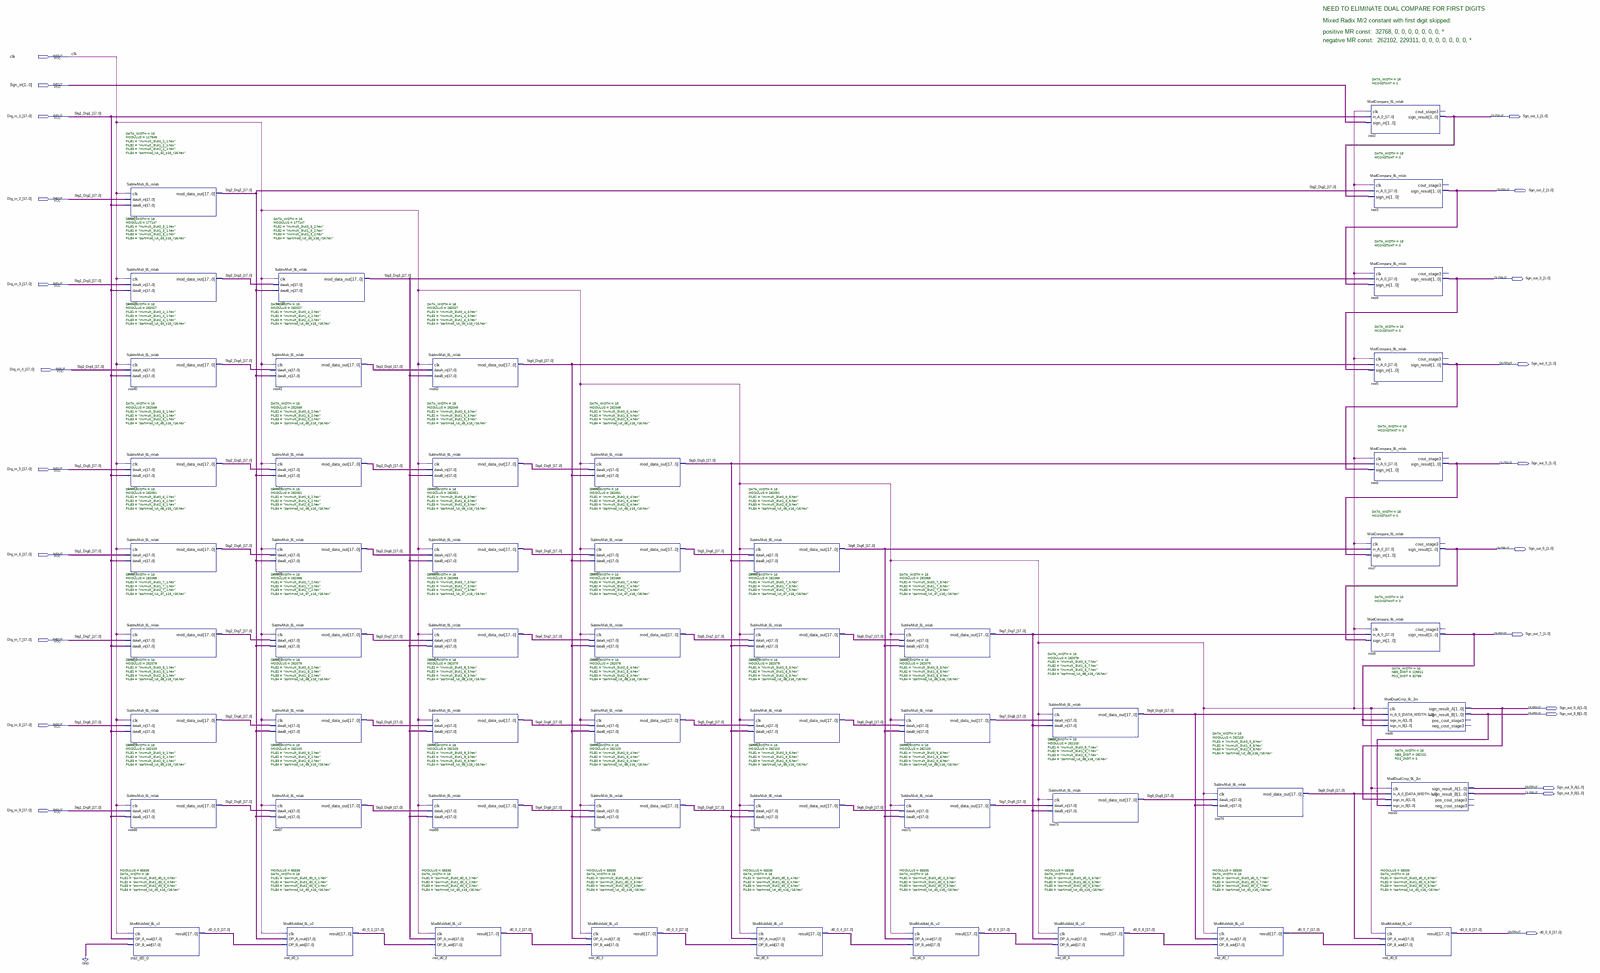
[diagram p0: schematic sheet, whole]
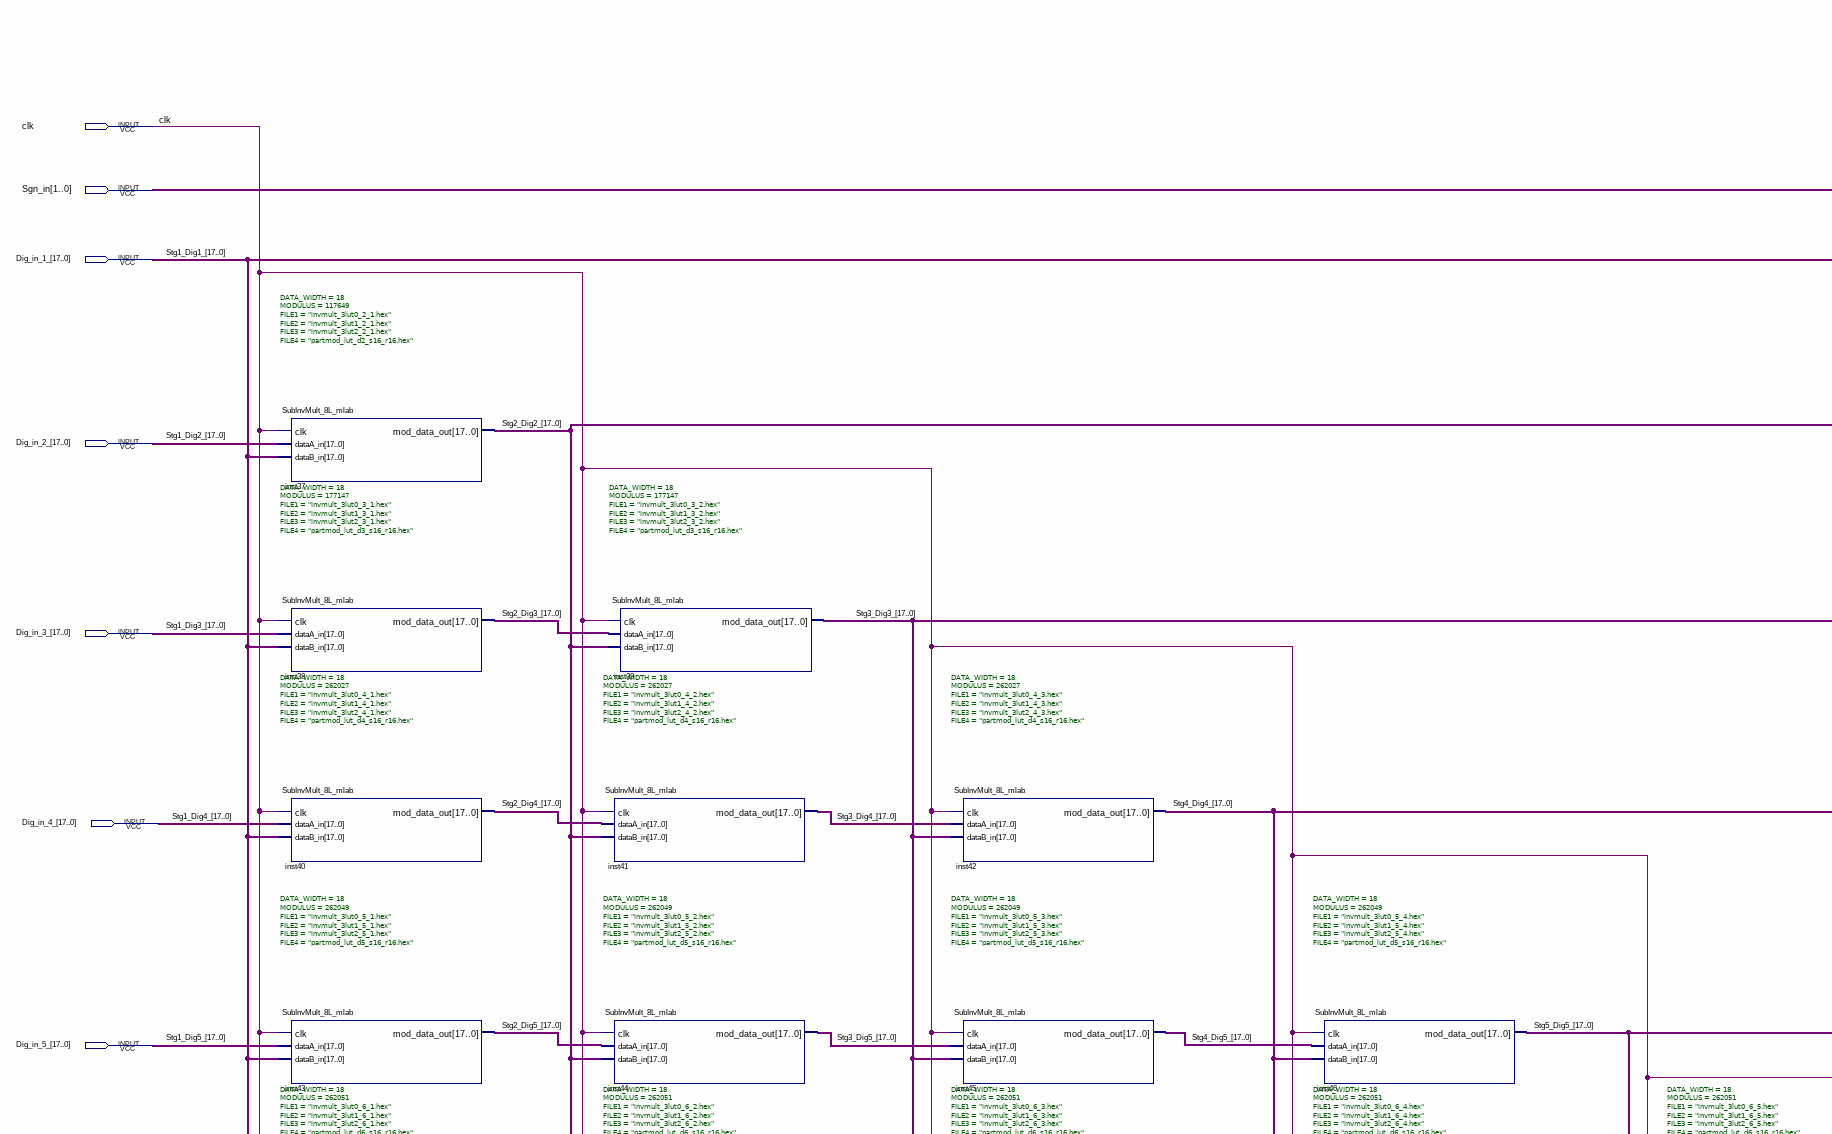
[diagram p1: schematic sheet, upper left part]
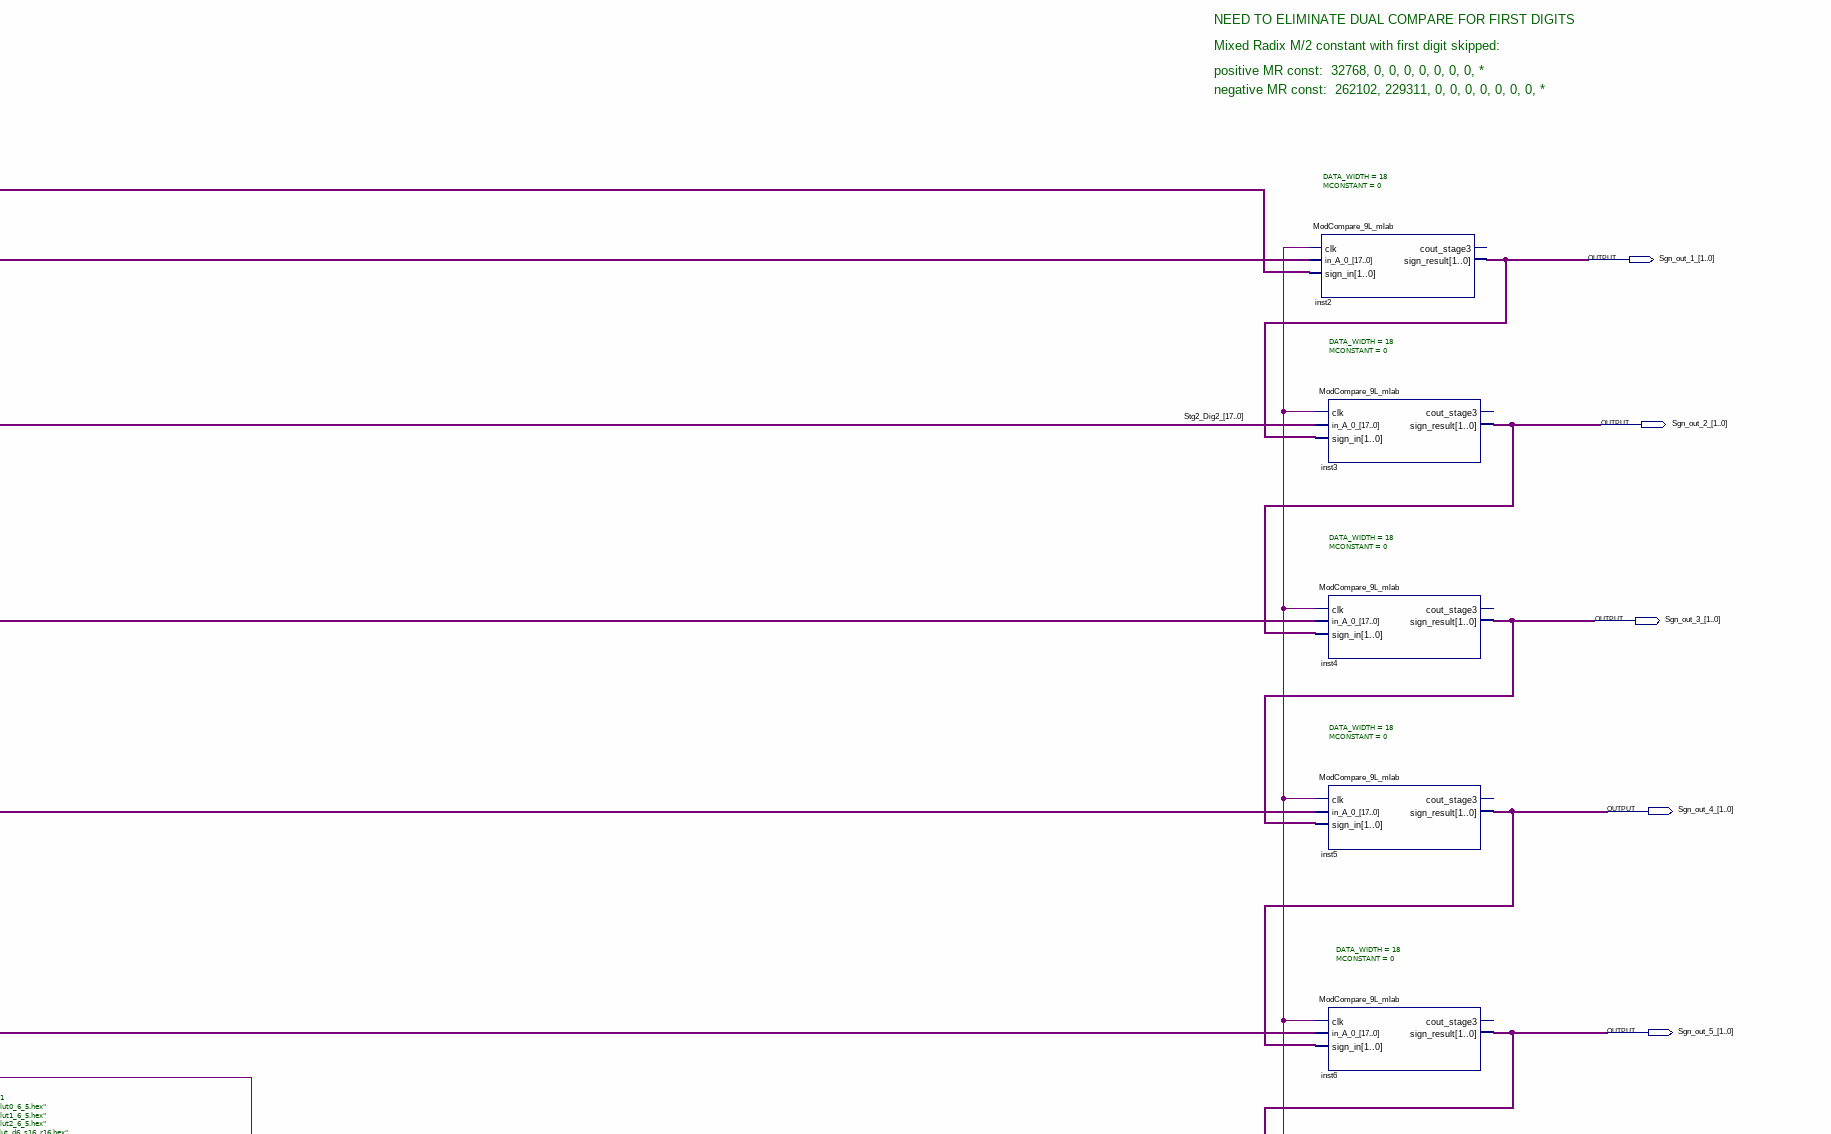
[diagram p2: schematic sheet, upper right part]
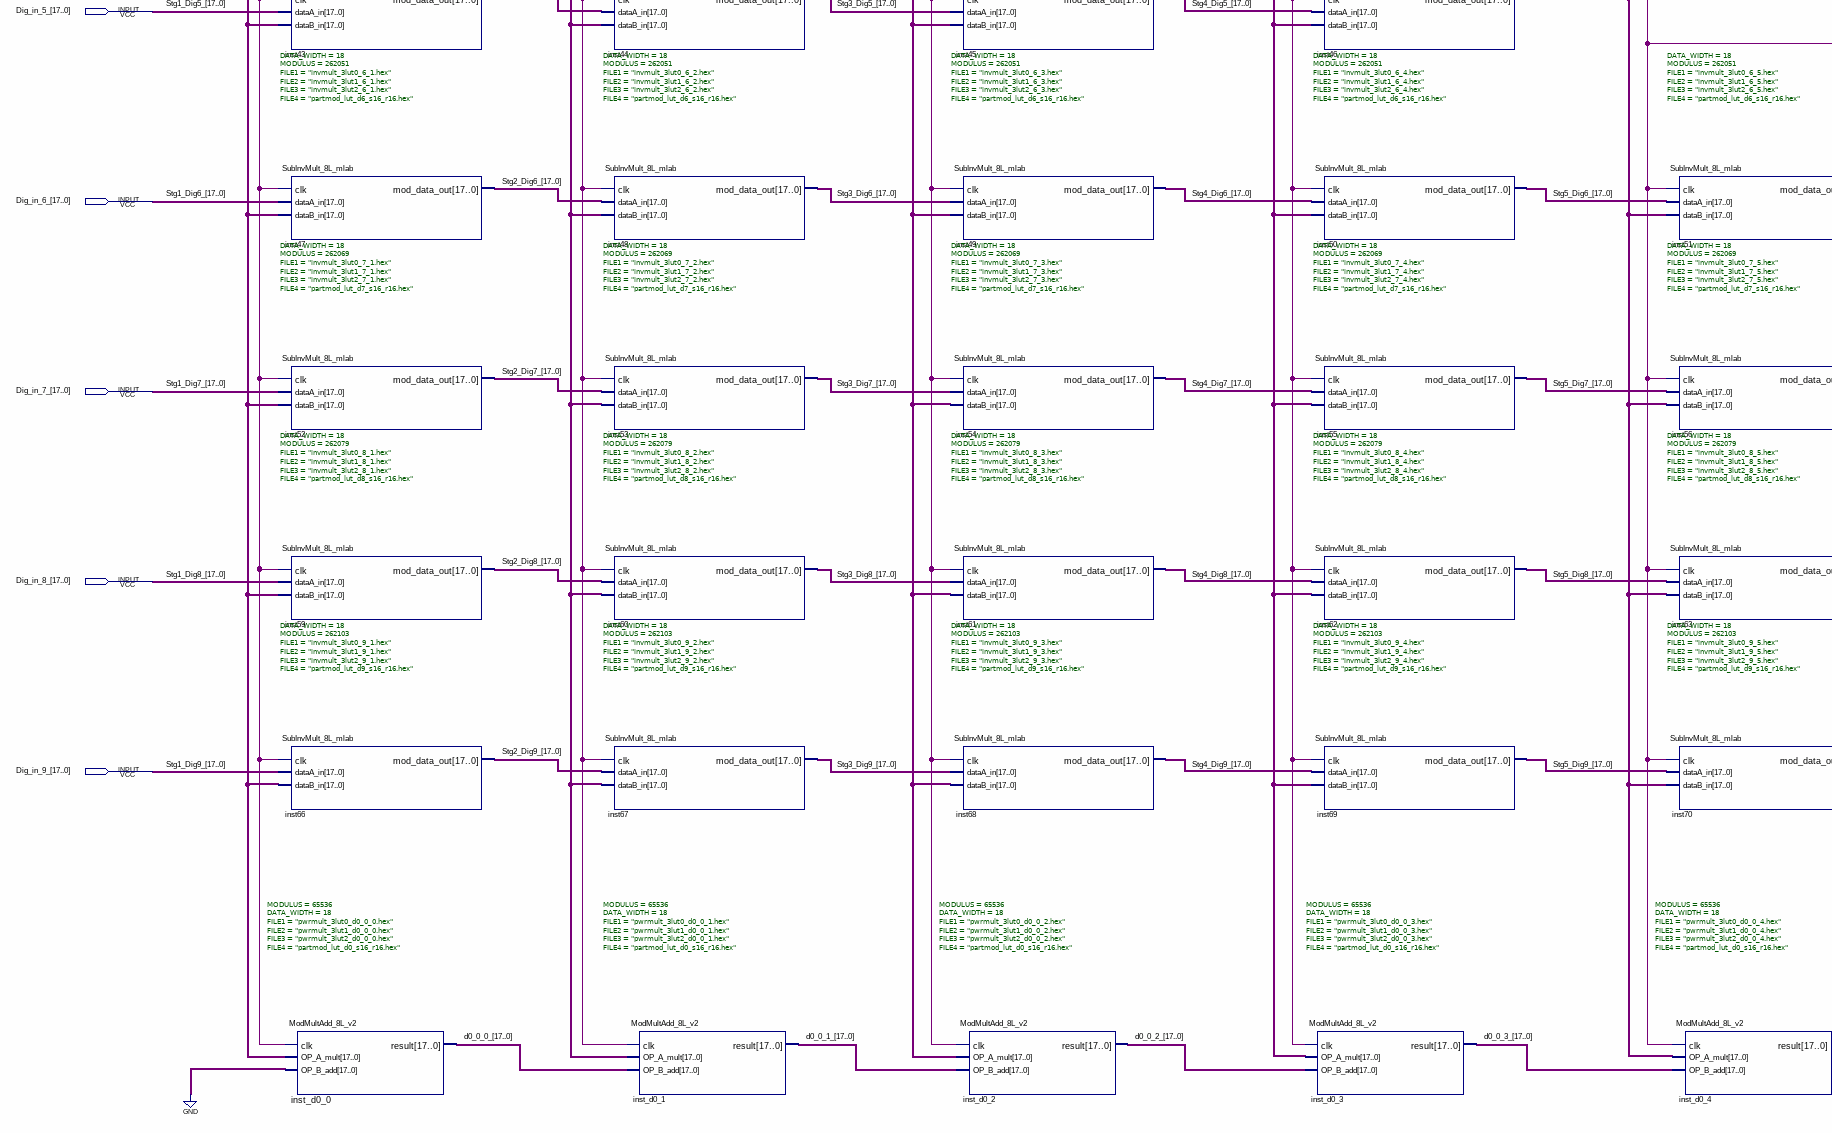
[diagram p3: schematic sheet, lower left part]
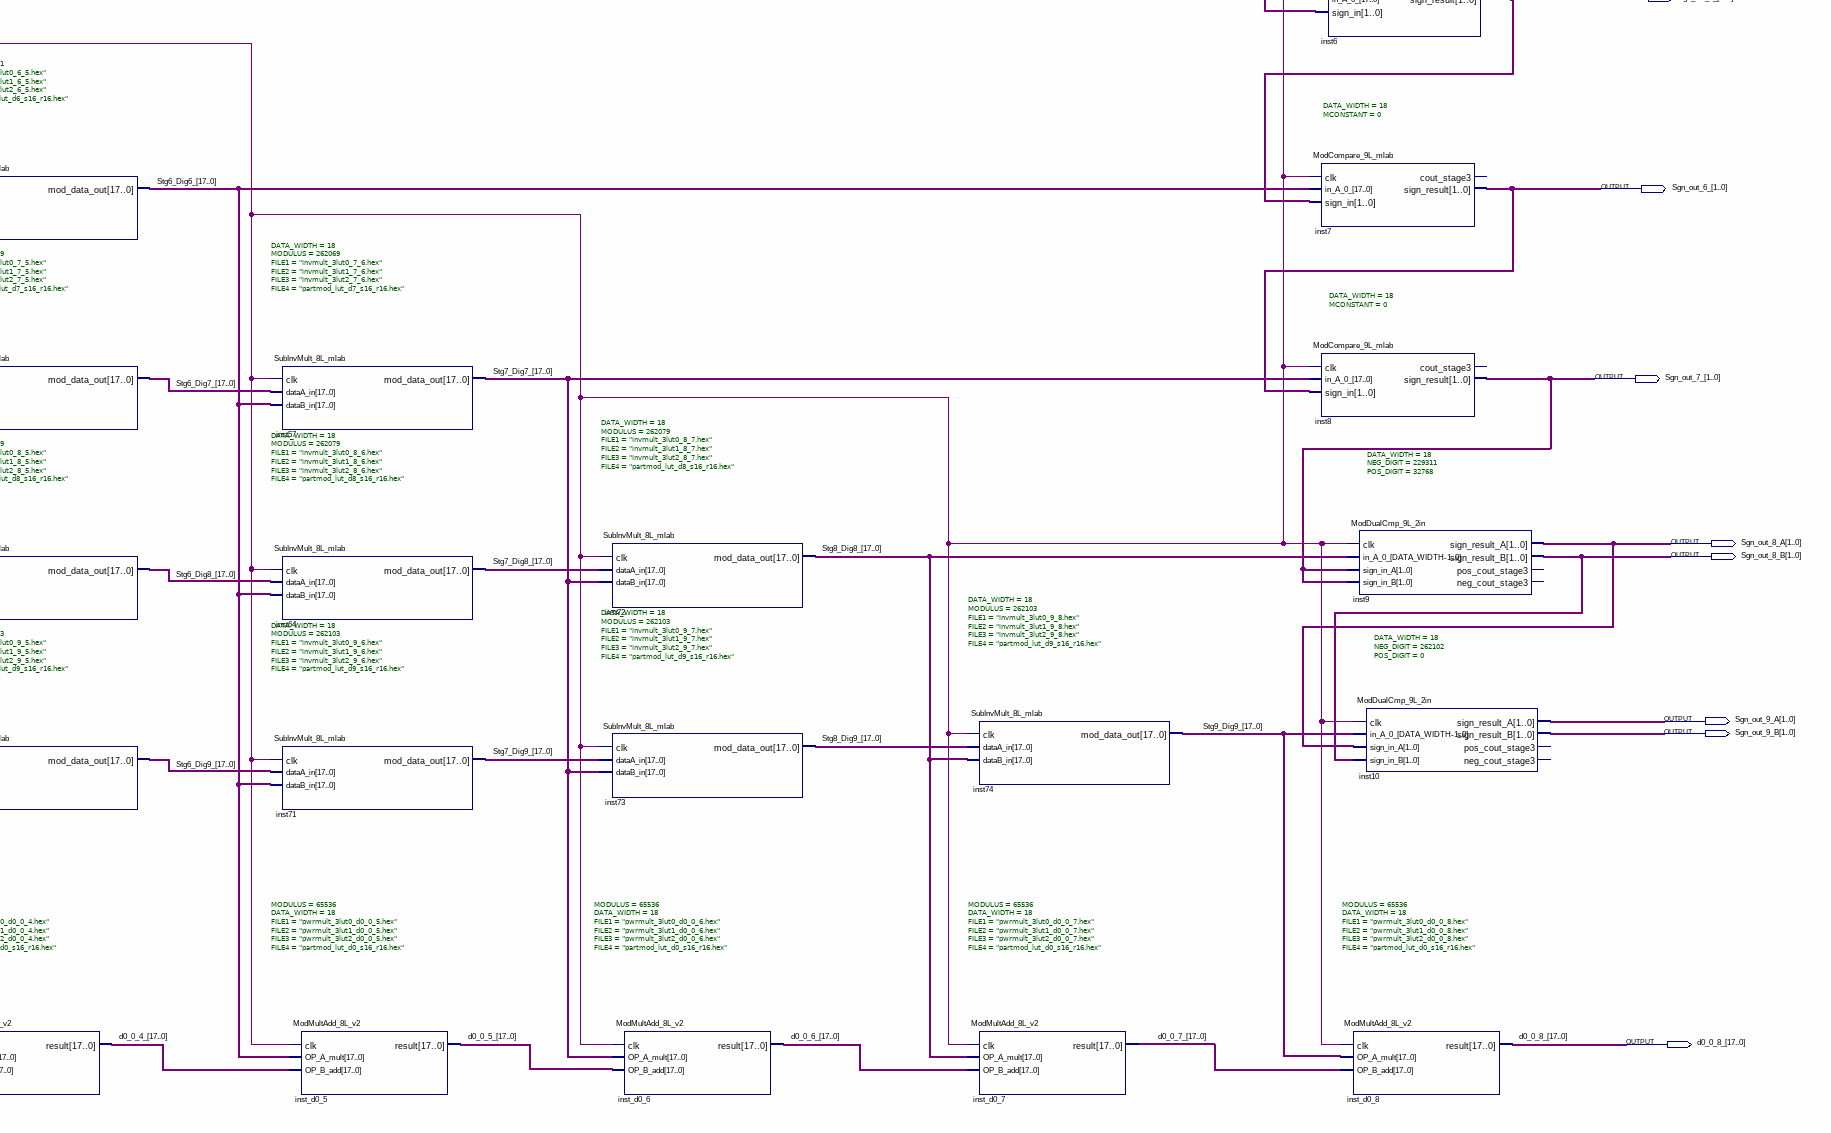
[diagram p4: schematic sheet, lower right part]
// Quartus schematic MRC_pipe_mlab_ec_skp0.bdf as structural Verilog: 54 symbols, 23 pins
module MRC_pipe_mlab_ec_skp0 (
  input  clk,
  input  [1:0] Sgn_in,
  input  [17:0] Dig_in_1_,
  input  [17:0] Dig_in_2_,
  input  [17:0] Dig_in_3_,
  input  [17:0] Dig_in_4_,
  input  [17:0] Dig_in_5_,
  input  [17:0] Dig_in_6_,
  input  [17:0] Dig_in_7_,
  input  [17:0] Dig_in_8_,
  input  [17:0] Dig_in_9_,
  output [1:0] Sgn_out_1_,
  output [1:0] Sgn_out_2_,
  output [1:0] Sgn_out_3_,
  output [1:0] Sgn_out_4_,
  output [1:0] Sgn_out_5_,
  output [1:0] Sgn_out_6_,
  output [1:0] Sgn_out_7_,
  output [1:0] Sgn_out_8_A,
  output [1:0] Sgn_out_8_B,
  output [1:0] Sgn_out_9_A,
  output [1:0] Sgn_out_9_B,
  output [17:0] d0_0_8_
);

  wire [17:0] d0_0_0_, d0_0_1_, d0_0_2_, d0_0_3_, d0_0_4_, d0_0_5_, d0_0_6_, d0_0_7_, Stg2_Dig2_, Stg2_Dig3_,
       Stg2_Dig4_, Stg2_Dig5_, Stg2_Dig6_, Stg2_Dig7_, Stg2_Dig8_, Stg2_Dig9_, Stg3_Dig3_, Stg3_Dig4_,
       Stg3_Dig5_, Stg3_Dig6_, Stg3_Dig7_, Stg3_Dig8_, Stg3_Dig9_, Stg4_Dig4_, Stg4_Dig5_, Stg4_Dig6_,
       Stg4_Dig7_, Stg4_Dig8_, Stg4_Dig9_, Stg5_Dig5_, Stg5_Dig6_, Stg5_Dig7_, Stg5_Dig8_, Stg5_Dig9_,
       Stg6_Dig6_, Stg6_Dig7_, Stg6_Dig8_, Stg6_Dig9_, Stg7_Dig7_, Stg7_Dig8_, Stg7_Dig9_, Stg8_Dig8_,
       Stg8_Dig9_, Stg9_Dig9_;

  SubInvMult_8L_mlab #(.DATA_WIDTH(18), .MODULUS(117649), .FILE1("invmult_3lut0_2_1.hex"), .FILE2("invmult_3lut1_2_1.hex"), .FILE3("invmult_3lut2_2_1.hex"), .FILE4("partmod_lut_d2_s16_r16.hex")) inst37 (
    .clk(clk), .dataA_in(Dig_in_2_), .dataB_in(Dig_in_1_), .mod_data_out(Stg2_Dig2_));
  SubInvMult_8L_mlab #(.DATA_WIDTH(18), .MODULUS(177147), .FILE1("invmult_3lut0_3_1.hex"), .FILE2("invmult_3lut1_3_1.hex"), .FILE3("invmult_3lut2_3_1.hex"), .FILE4("partmod_lut_d3_s16_r16.hex")) inst38 (
    .clk(clk), .dataA_in(Dig_in_3_), .dataB_in(Dig_in_1_), .mod_data_out(Stg2_Dig3_));
  SubInvMult_8L_mlab #(.DATA_WIDTH(18), .MODULUS(262027), .FILE1("invmult_3lut0_4_1.hex"), .FILE2("invmult_3lut1_4_1.hex"), .FILE3("invmult_3lut2_4_1.hex"), .FILE4("partmod_lut_d4_s16_r16.hex")) inst40 (
    .clk(clk), .dataA_in(Dig_in_4_), .dataB_in(Dig_in_1_), .mod_data_out(Stg2_Dig4_));
  SubInvMult_8L_mlab #(.DATA_WIDTH(18), .MODULUS(262049), .FILE1("invmult_3lut0_5_1.hex"), .FILE2("invmult_3lut1_5_1.hex"), .FILE3("invmult_3lut2_5_1.hex"), .FILE4("partmod_lut_d5_s16_r16.hex")) inst43 (
    .clk(clk), .dataA_in(Dig_in_5_), .dataB_in(Dig_in_1_), .mod_data_out(Stg2_Dig5_));
  SubInvMult_8L_mlab #(.DATA_WIDTH(18), .MODULUS(262051), .FILE1("invmult_3lut0_6_1.hex"), .FILE2("invmult_3lut1_6_1.hex"), .FILE3("invmult_3lut2_6_1.hex"), .FILE4("partmod_lut_d6_s16_r16.hex")) inst47 (
    .clk(clk), .dataA_in(Dig_in_6_), .dataB_in(Dig_in_1_), .mod_data_out(Stg2_Dig6_));
  SubInvMult_8L_mlab #(.DATA_WIDTH(18), .MODULUS(262069), .FILE1("invmult_3lut0_7_1.hex"), .FILE2("invmult_3lut1_7_1.hex"), .FILE3("invmult_3lut2_7_1.hex"), .FILE4("partmod_lut_d7_s16_r16.hex")) inst52 (
    .clk(clk), .dataA_in(Dig_in_7_), .dataB_in(Dig_in_1_), .mod_data_out(Stg2_Dig7_));
  SubInvMult_8L_mlab #(.DATA_WIDTH(18), .MODULUS(262079), .FILE1("invmult_3lut0_8_1.hex"), .FILE2("invmult_3lut1_8_1.hex"), .FILE3("invmult_3lut2_8_1.hex"), .FILE4("partmod_lut_d8_s16_r16.hex")) inst59 (
    .clk(clk), .dataA_in(Dig_in_8_), .dataB_in(Dig_in_1_), .mod_data_out(Stg2_Dig8_));
  SubInvMult_8L_mlab #(.DATA_WIDTH(18), .MODULUS(262103), .FILE1("invmult_3lut0_9_1.hex"), .FILE2("invmult_3lut1_9_1.hex"), .FILE3("invmult_3lut2_9_1.hex"), .FILE4("partmod_lut_d9_s16_r16.hex")) inst66 (
    .clk(clk), .dataA_in(Dig_in_9_), .dataB_in(Dig_in_1_), .mod_data_out(Stg2_Dig9_));
  ModMultAdd_8L_v2 #(.MODULUS(65536), .DATA_WIDTH(18), .FILE1("pwrmult_3lut0_d0_0_0.hex"), .FILE2("pwrmult_3lut1_d0_0_0.hex"), .FILE3("pwrmult_3lut2_d0_0_0.hex"), .FILE4("partmod_lut_d0_s16_r16.hex")) inst_d0_0 (
    .clk(clk), .OP_A_mult(Dig_in_1_), .OP_B_add({18{1'b0}}), .result(d0_0_0_));
  SubInvMult_8L_mlab #(.DATA_WIDTH(18), .MODULUS(177147), .FILE1("invmult_3lut0_3_2.hex"), .FILE2("invmult_3lut1_3_2.hex"), .FILE3("invmult_3lut2_3_2.hex"), .FILE4("partmod_lut_d3_s16_r16.hex")) inst39 (
    .clk(clk), .dataA_in(Stg2_Dig3_), .dataB_in(Stg2_Dig2_), .mod_data_out(Stg3_Dig3_));
  SubInvMult_8L_mlab #(.DATA_WIDTH(18), .MODULUS(262027), .FILE1("invmult_3lut0_4_2.hex"), .FILE2("invmult_3lut1_4_2.hex"), .FILE3("invmult_3lut2_4_2.hex"), .FILE4("partmod_lut_d4_s16_r16.hex")) inst41 (
    .clk(clk), .dataA_in(Stg2_Dig4_), .dataB_in(Stg2_Dig2_), .mod_data_out(Stg3_Dig4_));
  SubInvMult_8L_mlab #(.DATA_WIDTH(18), .MODULUS(262049), .FILE1("invmult_3lut0_5_2.hex"), .FILE2("invmult_3lut1_5_2.hex"), .FILE3("invmult_3lut2_5_2.hex"), .FILE4("partmod_lut_d5_s16_r16.hex")) inst44 (
    .clk(clk), .dataA_in(Stg2_Dig5_), .dataB_in(Stg2_Dig2_), .mod_data_out(Stg3_Dig5_));
  SubInvMult_8L_mlab #(.DATA_WIDTH(18), .MODULUS(262051), .FILE1("invmult_3lut0_6_2.hex"), .FILE2("invmult_3lut1_6_2.hex"), .FILE3("invmult_3lut2_6_2.hex"), .FILE4("partmod_lut_d6_s16_r16.hex")) inst48 (
    .clk(clk), .dataA_in(Stg2_Dig6_), .dataB_in(Stg2_Dig2_), .mod_data_out(Stg3_Dig6_));
  SubInvMult_8L_mlab #(.DATA_WIDTH(18), .MODULUS(262069), .FILE1("invmult_3lut0_7_2.hex"), .FILE2("invmult_3lut1_7_2.hex"), .FILE3("invmult_3lut2_7_2.hex"), .FILE4("partmod_lut_d7_s16_r16.hex")) inst53 (
    .clk(clk), .dataA_in(Stg2_Dig7_), .dataB_in(Stg2_Dig2_), .mod_data_out(Stg3_Dig7_));
  SubInvMult_8L_mlab #(.DATA_WIDTH(18), .MODULUS(262079), .FILE1("invmult_3lut0_8_2.hex"), .FILE2("invmult_3lut1_8_2.hex"), .FILE3("invmult_3lut2_8_2.hex"), .FILE4("partmod_lut_d8_s16_r16.hex")) inst60 (
    .clk(clk), .dataA_in(Stg2_Dig8_), .dataB_in(Stg2_Dig2_), .mod_data_out(Stg3_Dig8_));
  SubInvMult_8L_mlab #(.DATA_WIDTH(18), .MODULUS(262103), .FILE1("invmult_3lut0_9_2.hex"), .FILE2("invmult_3lut1_9_2.hex"), .FILE3("invmult_3lut2_9_2.hex"), .FILE4("partmod_lut_d9_s16_r16.hex")) inst67 (
    .clk(clk), .dataA_in(Stg2_Dig9_), .dataB_in(Stg2_Dig2_), .mod_data_out(Stg3_Dig9_));
  ModMultAdd_8L_v2 #(.MODULUS(65536), .DATA_WIDTH(18), .FILE1("pwrmult_3lut0_d0_0_1.hex"), .FILE2("pwrmult_3lut1_d0_0_1.hex"), .FILE3("pwrmult_3lut2_d0_0_1.hex"), .FILE4("partmod_lut_d0_s16_r16.hex")) inst_d0_1 (
    .clk(clk), .OP_A_mult(Stg2_Dig2_), .OP_B_add(d0_0_0_), .result(d0_0_1_));
  SubInvMult_8L_mlab #(.DATA_WIDTH(18), .MODULUS(262027), .FILE1("invmult_3lut0_4_3.hex"), .FILE2("invmult_3lut1_4_3.hex"), .FILE3("invmult_3lut2_4_3.hex"), .FILE4("partmod_lut_d4_s16_r16.hex")) inst42 (
    .clk(clk), .dataA_in(Stg3_Dig4_), .dataB_in(Stg3_Dig3_), .mod_data_out(Stg4_Dig4_));
  SubInvMult_8L_mlab #(.DATA_WIDTH(18), .MODULUS(262049), .FILE1("invmult_3lut0_5_3.hex"), .FILE2("invmult_3lut1_5_3.hex"), .FILE3("invmult_3lut2_5_3.hex"), .FILE4("partmod_lut_d5_s16_r16.hex")) inst45 (
    .clk(clk), .dataA_in(Stg3_Dig5_), .dataB_in(Stg3_Dig3_), .mod_data_out(Stg4_Dig5_));
  SubInvMult_8L_mlab #(.DATA_WIDTH(18), .MODULUS(262051), .FILE1("invmult_3lut0_6_3.hex"), .FILE2("invmult_3lut1_6_3.hex"), .FILE3("invmult_3lut2_6_3.hex"), .FILE4("partmod_lut_d6_s16_r16.hex")) inst49 (
    .clk(clk), .dataA_in(Stg3_Dig6_), .dataB_in(Stg3_Dig3_), .mod_data_out(Stg4_Dig6_));
  SubInvMult_8L_mlab #(.DATA_WIDTH(18), .MODULUS(262069), .FILE1("invmult_3lut0_7_3.hex"), .FILE2("invmult_3lut1_7_3.hex"), .FILE3("invmult_3lut2_7_3.hex"), .FILE4("partmod_lut_d7_s16_r16.hex")) inst54 (
    .clk(clk), .dataA_in(Stg3_Dig7_), .dataB_in(Stg3_Dig3_), .mod_data_out(Stg4_Dig7_));
  SubInvMult_8L_mlab #(.DATA_WIDTH(18), .MODULUS(262079), .FILE1("invmult_3lut0_8_3.hex"), .FILE2("invmult_3lut1_8_3.hex"), .FILE3("invmult_3lut2_8_3.hex"), .FILE4("partmod_lut_d8_s16_r16.hex")) inst61 (
    .clk(clk), .dataA_in(Stg3_Dig8_), .dataB_in(Stg3_Dig3_), .mod_data_out(Stg4_Dig8_));
  SubInvMult_8L_mlab #(.DATA_WIDTH(18), .MODULUS(262103), .FILE1("invmult_3lut0_9_3.hex"), .FILE2("invmult_3lut1_9_3.hex"), .FILE3("invmult_3lut2_9_3.hex"), .FILE4("partmod_lut_d9_s16_r16.hex")) inst68 (
    .clk(clk), .dataA_in(Stg3_Dig9_), .dataB_in(Stg3_Dig3_), .mod_data_out(Stg4_Dig9_));
  ModMultAdd_8L_v2 #(.MODULUS(65536), .DATA_WIDTH(18), .FILE1("pwrmult_3lut0_d0_0_2.hex"), .FILE2("pwrmult_3lut1_d0_0_2.hex"), .FILE3("pwrmult_3lut2_d0_0_2.hex"), .FILE4("partmod_lut_d0_s16_r16.hex")) inst_d0_2 (
    .clk(clk), .OP_A_mult(Stg3_Dig3_), .OP_B_add(d0_0_1_), .result(d0_0_2_));
  ModMultAdd_8L_v2 #(.MODULUS(65536), .DATA_WIDTH(18), .FILE1("pwrmult_3lut0_d0_0_3.hex"), .FILE2("pwrmult_3lut1_d0_0_3.hex"), .FILE3("pwrmult_3lut2_d0_0_3.hex"), .FILE4("partmod_lut_d0_s16_r16.hex")) inst_d0_3 (
    .clk(clk), .OP_A_mult(Stg4_Dig4_), .OP_B_add(d0_0_2_), .result(d0_0_3_));
  SubInvMult_8L_mlab #(.DATA_WIDTH(18), .MODULUS(262049), .FILE1("invmult_3lut0_5_4.hex"), .FILE2("invmult_3lut1_5_4.hex"), .FILE3("invmult_3lut2_5_4.hex"), .FILE4("partmod_lut_d5_s16_r16.hex")) inst46 (
    .clk(clk), .dataA_in(Stg4_Dig5_), .dataB_in(Stg4_Dig4_), .mod_data_out(Stg5_Dig5_));
  SubInvMult_8L_mlab #(.DATA_WIDTH(18), .MODULUS(262051), .FILE1("invmult_3lut0_6_4.hex"), .FILE2("invmult_3lut1_6_4.hex"), .FILE3("invmult_3lut2_6_4.hex"), .FILE4("partmod_lut_d6_s16_r16.hex")) inst50 (
    .clk(clk), .dataA_in(Stg4_Dig6_), .dataB_in(Stg4_Dig4_), .mod_data_out(Stg5_Dig6_));
  SubInvMult_8L_mlab #(.DATA_WIDTH(18), .MODULUS(262069), .FILE1("invmult_3lut0_7_4.hex"), .FILE2("invmult_3lut1_7_4.hex"), .FILE3("invmult_3lut2_7_4.hex"), .FILE4("partmod_lut_d7_s16_r16.hex")) inst55 (
    .clk(clk), .dataA_in(Stg4_Dig7_), .dataB_in(Stg4_Dig4_), .mod_data_out(Stg5_Dig7_));
  SubInvMult_8L_mlab #(.DATA_WIDTH(18), .MODULUS(262079), .FILE1("invmult_3lut0_8_4.hex"), .FILE2("invmult_3lut1_8_4.hex"), .FILE3("invmult_3lut2_8_4.hex"), .FILE4("partmod_lut_d8_s16_r16.hex")) inst62 (
    .clk(clk), .dataA_in(Stg4_Dig8_), .dataB_in(Stg4_Dig4_), .mod_data_out(Stg5_Dig8_));
  SubInvMult_8L_mlab #(.DATA_WIDTH(18), .MODULUS(262103), .FILE1("invmult_3lut0_9_4.hex"), .FILE2("invmult_3lut1_9_4.hex"), .FILE3("invmult_3lut2_9_4.hex"), .FILE4("partmod_lut_d9_s16_r16.hex")) inst69 (
    .clk(clk), .dataA_in(Stg4_Dig9_), .dataB_in(Stg4_Dig4_), .mod_data_out(Stg5_Dig9_));
  SubInvMult_8L_mlab #(.DATA_WIDTH(18), .MODULUS(262051), .FILE1("invmult_3lut0_6_5.hex"), .FILE2("invmult_3lut1_6_5.hex"), .FILE3("invmult_3lut2_6_5.hex"), .FILE4("partmod_lut_d6_s16_r16.hex")) inst51 (
    .clk(clk), .dataA_in(Stg5_Dig6_), .dataB_in(Stg5_Dig5_), .mod_data_out(Stg6_Dig6_));
  SubInvMult_8L_mlab #(.DATA_WIDTH(18), .MODULUS(262069), .FILE1("invmult_3lut0_7_5.hex"), .FILE2("invmult_3lut1_7_5.hex"), .FILE3("invmult_3lut2_7_5.hex"), .FILE4("partmod_lut_d7_s16_r16.hex")) inst56 (
    .clk(clk), .dataA_in(Stg5_Dig7_), .dataB_in(Stg5_Dig5_), .mod_data_out(Stg6_Dig7_));
  SubInvMult_8L_mlab #(.DATA_WIDTH(18), .MODULUS(262079), .FILE1("invmult_3lut0_8_5.hex"), .FILE2("invmult_3lut1_8_5.hex"), .FILE3("invmult_3lut2_8_5.hex"), .FILE4("partmod_lut_d8_s16_r16.hex")) inst63 (
    .clk(clk), .dataA_in(Stg5_Dig8_), .dataB_in(Stg5_Dig5_), .mod_data_out(Stg6_Dig8_));
  SubInvMult_8L_mlab #(.DATA_WIDTH(18), .MODULUS(262103), .FILE1("invmult_3lut0_9_5.hex"), .FILE2("invmult_3lut1_9_5.hex"), .FILE3("invmult_3lut2_9_5.hex"), .FILE4("partmod_lut_d9_s16_r16.hex")) inst70 (
    .clk(clk), .dataA_in(Stg5_Dig9_), .dataB_in(Stg5_Dig5_), .mod_data_out(Stg6_Dig9_));
  ModMultAdd_8L_v2 #(.MODULUS(65536), .DATA_WIDTH(18), .FILE1("pwrmult_3lut0_d0_0_4.hex"), .FILE2("pwrmult_3lut1_d0_0_4.hex"), .FILE3("pwrmult_3lut2_d0_0_4.hex"), .FILE4("partmod_lut_d0_s16_r16.hex")) inst_d0_4 (
    .clk(clk), .OP_A_mult(Stg5_Dig5_), .OP_B_add(d0_0_3_), .result(d0_0_4_));
  SubInvMult_8L_mlab #(.DATA_WIDTH(18), .MODULUS(262069), .FILE1("invmult_3lut0_7_6.hex"), .FILE2("invmult_3lut1_7_6.hex"), .FILE3("invmult_3lut2_7_6.hex"), .FILE4("partmod_lut_d7_s16_r16.hex")) inst57 (
    .clk(clk), .dataA_in(Stg6_Dig7_), .dataB_in(Stg6_Dig6_), .mod_data_out(Stg7_Dig7_));
  SubInvMult_8L_mlab #(.DATA_WIDTH(18), .MODULUS(262079), .FILE1("invmult_3lut0_8_6.hex"), .FILE2("invmult_3lut1_8_6.hex"), .FILE3("invmult_3lut2_8_6.hex"), .FILE4("partmod_lut_d8_s16_r16.hex")) inst64 (
    .clk(clk), .dataA_in(Stg6_Dig8_), .dataB_in(Stg6_Dig6_), .mod_data_out(Stg7_Dig8_));
  SubInvMult_8L_mlab #(.DATA_WIDTH(18), .MODULUS(262103), .FILE1("invmult_3lut0_9_6.hex"), .FILE2("invmult_3lut1_9_6.hex"), .FILE3("invmult_3lut2_9_6.hex"), .FILE4("partmod_lut_d9_s16_r16.hex")) inst71 (
    .clk(clk), .dataA_in(Stg6_Dig9_), .dataB_in(Stg6_Dig6_), .mod_data_out(Stg7_Dig9_));
  ModMultAdd_8L_v2 #(.MODULUS(65536), .DATA_WIDTH(18), .FILE1("pwrmult_3lut0_d0_0_5.hex"), .FILE2("pwrmult_3lut1_d0_0_5.hex"), .FILE3("pwrmult_3lut2_d0_0_5.hex"), .FILE4("partmod_lut_d0_s16_r16.hex")) inst_d0_5 (
    .clk(clk), .OP_A_mult(Stg6_Dig6_), .OP_B_add(d0_0_4_), .result(d0_0_5_));
  SubInvMult_8L_mlab #(.DATA_WIDTH(18), .MODULUS(262079), .FILE1("invmult_3lut0_8_7.hex"), .FILE2("invmult_3lut1_8_7.hex"), .FILE3("invmult_3lut2_8_7.hex"), .FILE4("partmod_lut_d8_s16_r16.hex")) inst72 (
    .clk(clk), .dataA_in(Stg7_Dig8_), .dataB_in(Stg7_Dig7_), .mod_data_out(Stg8_Dig8_));
  SubInvMult_8L_mlab #(.DATA_WIDTH(18), .MODULUS(262103), .FILE1("invmult_3lut0_9_7.hex"), .FILE2("invmult_3lut1_9_7.hex"), .FILE3("invmult_3lut2_9_7.hex"), .FILE4("partmod_lut_d9_s16_r16.hex")) inst73 (
    .clk(clk), .dataA_in(Stg7_Dig9_), .dataB_in(Stg7_Dig7_), .mod_data_out(Stg8_Dig9_));
  ModMultAdd_8L_v2 #(.MODULUS(65536), .DATA_WIDTH(18), .FILE1("pwrmult_3lut0_d0_0_6.hex"), .FILE2("pwrmult_3lut1_d0_0_6.hex"), .FILE3("pwrmult_3lut2_d0_0_6.hex"), .FILE4("partmod_lut_d0_s16_r16.hex")) inst_d0_6 (
    .clk(clk), .OP_A_mult(Stg7_Dig7_), .OP_B_add(d0_0_5_), .result(d0_0_6_));
  SubInvMult_8L_mlab #(.DATA_WIDTH(18), .MODULUS(262103), .FILE1("invmult_3lut0_9_8.hex"), .FILE2("invmult_3lut1_9_8.hex"), .FILE3("invmult_3lut2_9_8.hex"), .FILE4("partmod_lut_d9_s16_r16.hex")) inst74 (
    .clk(clk), .dataA_in(Stg8_Dig9_), .dataB_in(Stg8_Dig8_), .mod_data_out(Stg9_Dig9_));
  ModMultAdd_8L_v2 #(.MODULUS(65536), .DATA_WIDTH(18), .FILE1("pwrmult_3lut0_d0_0_7.hex"), .FILE2("pwrmult_3lut1_d0_0_7.hex"), .FILE3("pwrmult_3lut2_d0_0_7.hex"), .FILE4("partmod_lut_d0_s16_r16.hex")) inst_d0_7 (
    .clk(clk), .OP_A_mult(Stg8_Dig8_), .OP_B_add(d0_0_6_), .result(d0_0_7_));
  ModCompare_9L_mlab #(.DATA_WIDTH(18), .MCONSTANT(0)) inst2 (
    .clk(clk), .in_A_0_(Dig_in_1_), .sign_in(Sgn_in), .sign_result(Sgn_out_1_));  // open: cout_stage3
  ModCompare_9L_mlab #(.DATA_WIDTH(18), .MCONSTANT(0)) inst3 (
    .clk(clk), .in_A_0_(Stg2_Dig2_), .sign_in(Sgn_out_1_), .sign_result(Sgn_out_2_));  // open: cout_stage3
  ModCompare_9L_mlab #(.DATA_WIDTH(18), .MCONSTANT(0)) inst4 (
    .clk(clk), .in_A_0_(Stg3_Dig3_), .sign_in(Sgn_out_2_), .sign_result(Sgn_out_3_));  // open: cout_stage3
  ModCompare_9L_mlab #(.DATA_WIDTH(18), .MCONSTANT(0)) inst5 (
    .clk(clk), .in_A_0_(Stg4_Dig4_), .sign_in(Sgn_out_3_), .sign_result(Sgn_out_4_));  // open: cout_stage3
  ModCompare_9L_mlab #(.DATA_WIDTH(18), .MCONSTANT(0)) inst6 (
    .clk(clk), .in_A_0_(Stg5_Dig5_), .sign_in(Sgn_out_4_), .sign_result(Sgn_out_5_));  // open: cout_stage3
  ModCompare_9L_mlab #(.DATA_WIDTH(18), .MCONSTANT(0)) inst7 (
    .clk(clk), .in_A_0_(Stg6_Dig6_), .sign_in(Sgn_out_5_), .sign_result(Sgn_out_6_));  // open: cout_stage3
  ModCompare_9L_mlab #(.DATA_WIDTH(18), .MCONSTANT(0)) inst8 (
    .clk(clk), .in_A_0_(Stg7_Dig7_), .sign_in(Sgn_out_6_), .sign_result(Sgn_out_7_));  // open: cout_stage3
  ModDualCmp_9L_2in #(.DATA_WIDTH(18), .NEG_DIGIT(229311), .POS_DIGIT(32768)) inst9 (
    .clk(clk), .in_A_0_(Stg8_Dig8_), .sign_in_A(Sgn_out_7_), .sign_in_B(Sgn_out_7_),
    .sign_result_A(Sgn_out_8_A), .sign_result_B(Sgn_out_8_B));  // open: pos_cout_stage3, neg_cout_stage3
  ModMultAdd_8L_v2 #(.MODULUS(65536), .DATA_WIDTH(18), .FILE1("pwrmult_3lut0_d0_0_8.hex"), .FILE2("pwrmult_3lut1_d0_0_8.hex"), .FILE3("pwrmult_3lut2_d0_0_8.hex"), .FILE4("partmod_lut_d0_s16_r16.hex")) inst_d0_8 (
    .clk(clk), .OP_A_mult(Stg9_Dig9_), .OP_B_add(d0_0_7_), .result(d0_0_8_));
  ModDualCmp_9L_2in #(.DATA_WIDTH(18), .NEG_DIGIT(262102), .POS_DIGIT(0)) inst10 (
    .clk(clk), .in_A_0_(Stg9_Dig9_), .sign_in_A(Sgn_out_8_A), .sign_in_B(Sgn_out_8_B),
    .sign_result_A(Sgn_out_9_A), .sign_result_B(Sgn_out_9_B));  // open: pos_cout_stage3, neg_cout_stage3

  // Other names for the same wires on the sheet: Stg1_Dig1_[17:0] = Dig_in_1_; Stg1_Dig2_[17:0] = Dig_in_2_;
  //   Stg1_Dig3_[17:0] = Dig_in_3_; Stg1_Dig4_[17:0] = Dig_in_4_; Stg1_Dig5_[17:0] = Dig_in_5_;
  //   Stg1_Dig6_[17:0] = Dig_in_6_; Stg1_Dig7_[17:0] = Dig_in_7_; Stg1_Dig8_[17:0] = Dig_in_8_;
  //   Stg1_Dig9_[17:0] = Dig_in_9_

  // Notes on the sheet:
  //   NEED TO ELIMINATE DUAL COMPARE FOR FIRST DIGITS
  //   Mixed Radix M/2 constant with first digit skipped:
  //   positive MR const:  32768, 0, 0, 0, 0, 0, 0, 0, *
  //   negative MR const:  262102, 229311, 0, 0, 0, 0, 0, 0, 0, *
endmodule
